# EAGLE design HallEffectModule (EAGLE 5.10)
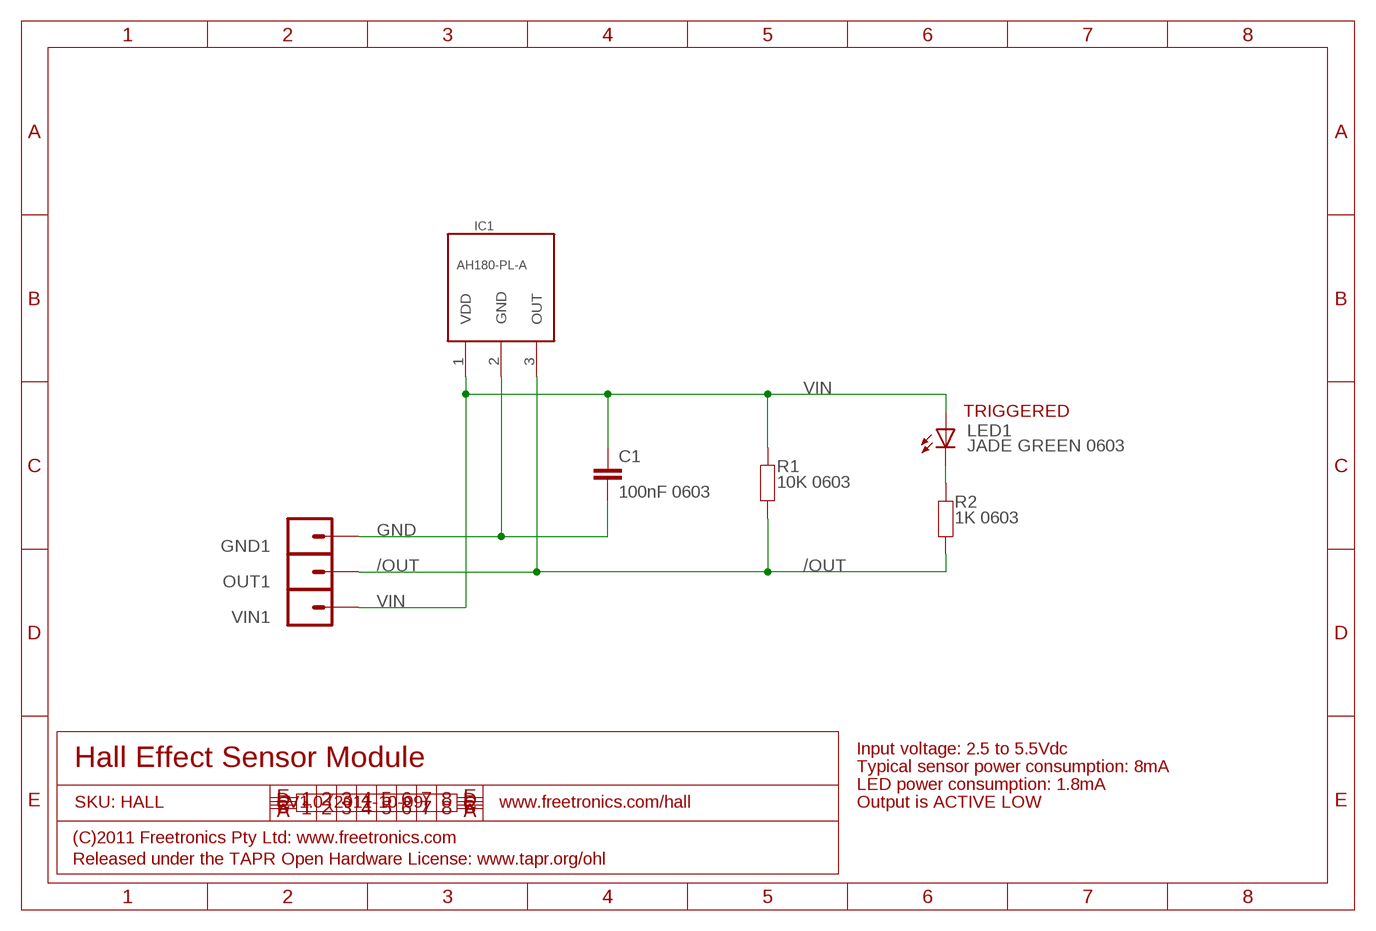
[diagram p0: schematic, sheet 1]

## Parts
C1  100nF 0603  CAP0603  [0603]
GND1  M01PTH  [1X01]
IC1  AH180-PL-A  US1881TO92  [TO92FLATUP]
LED1  JADE GREEN 0603  LED0603  [LED-0603]
OUT1  M01PTH  [1X01]
R1  10K 0603  RESISTOR0603  [0603]
R2  1K 0603  RESISTOR0603  [0603]
VIN1  M01PTH  [1X01]

## Nets
/OUT: IC1.3(OUT) OUT1.1 R1.1 R2.2
GND: C1.2 GND1.1 IC1.2(GND)
N$1: LED1.C R2.1
VIN: C1.1 IC1.1(VDD) LED1.A R1.2 VIN1.1

## Notes on the sheet
- TRIGGERED
- Input voltage: 2.5 to 5.5Vdc
- Hall Effect Sensor Module
- Typical sensor power consumption: 8mA
- LED power consumption: 1.8mA
- SKU: HALL | V1.0 (2011-10-09) | www.freetronics.com/hall | Output is ACTIVE LOW
- (C)2011 Freetronics Pty Ltd: www.freetronics.com
- Released under the TAPR Open Hardware License: www.tapr.org/ohl

## Library data of the parts
C1 = freetronics-master-v1.1:CAP: Capacitor Standard 0603 ceramic capacitor, and 0.1" leaded capacitor.
GND1 OUT1 VIN1 = freetronics-master-v1:M01: Header 1 Standard 1-pin 0.1" header. Use with straight break away headers (SKU : PRT-00116), right angle break away headers (PRT-00553), swiss pins (PRT-00743), machine pins (PRT-00117), and female headers (PRT-00115).
IC1 = freetronics-jon:US1881
LED1 = freetronics-marc:LED: LEDs Standard schematic elements and footprints for 5mm, 3mm, 1206, and 0603 sized LEDs. 5mm - Spark Fun Electronics SKU : COM-00529 (and others)
R1 R2 = freetronics-master-v1:RESISTOR: Resistor Basic schematic elements and footprints for 0603, 1206, and PTH 1/10th watt (small) resistors.

## Board
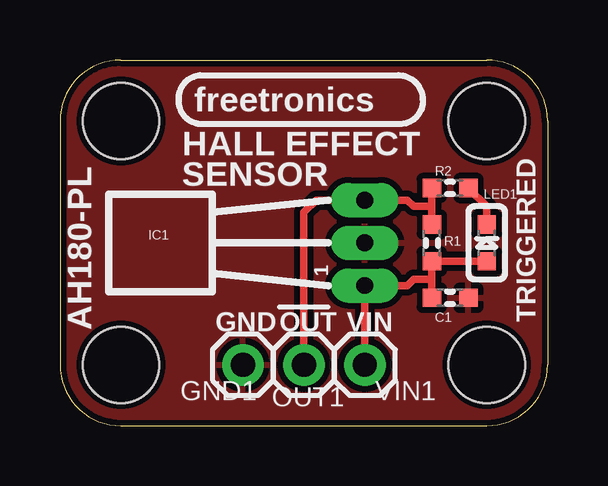
[diagram p1: board, top side]
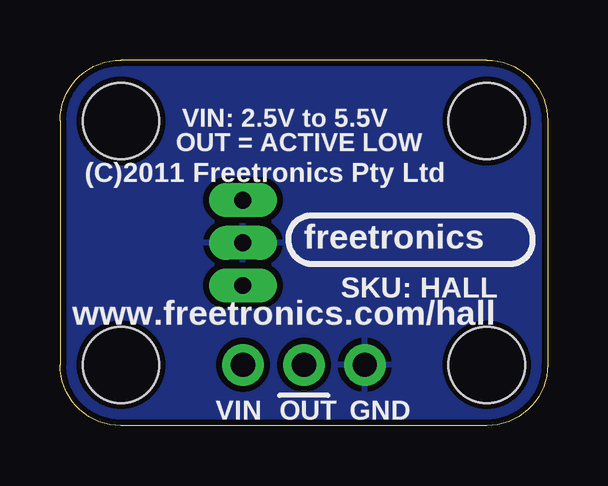
[diagram p2: board, bottom side, seen from below]

Size 20.32 x 15.24 mm. Coordinates in mm from the lower left corner, seen from the top.
Outline: 0,2.54 arc90 2.54,0 17.78,0 arc90 20.32,2.54 20.32,12.7 arc90 17.78,15.24 2.54,15.24 arc90 0,12.7 0,2.54
Copper layers (1*16): Top 0.035mm / dielectric 1.5mm / Bottom 0.035mm
Design rules "default *": minimum track width 8mil, minimum drill 15mil, track to track 10mil, track to pad 10mil, pad to pad 10mil, via to via 10mil, smd to smd 8mil, copper to edge 10mil, drill to drill 8mil, minimum pad ring 14mil, minimum via ring 8mil, stop-mask expansion 4mil, vias tented up to drill 25mil, thermal gap 10mil
Holes 3.17 mm at 2.54,2.54 17.78,2.54 2.54,12.7 17.78,12.7

### Footprints (pad centres in the part's own frame; a part is rotated, then mirrored left to right if it is on the bottom)
0603 = smd 0.762 x 0.762: 1 -0.762,0; 2 0.762,0
1X01 = drill 1.016 round: 1 0,0
TO92FLATUP = drill 0.7 long: 1 -1.778,0; 2 0,0; 3 1.778,0
LED-0603 = smd 0.762 x 0.762: A -0.762,0; C 0.762,0

### Placement (x,y rotation side)
C1  16.26,5.33 0 top
GND1  7.62,2.54 0 top
IC1  12.7,7.62 90 top
LED1  17.78,7.62 90 top
OUT1  10.16,2.54 0 top
R1  15.49,7.62 270 top
R2  16.26,9.91 180 top
VIN1  12.7,2.54 0 top

### Tracks (layer width: path | path; a pad name or v marks a point on that pad's centre or on a via)
/OUT
  Top 0.305: OUT1.1 10.16,8.89 10.67,9.4 IC1.3 14.48,9.4 14.73,9.14 15.49,9.14 | 15.49,9.14 R2.2 | 15.49,9.14 R1.1
GND
  pour Bottom: 2.54,15.24 arc90 0,12.7 0,2.54 arc90 2.54,0 17.78,0 arc90 20.32,2.54 20.32,12.7 arc90 17.78,15.24
  pour Top: 0,12.7 0,2.54 arc90 2.54,0 17.78,0 arc90 20.32,2.54 20.32,12.7 arc90 17.78,15.24 2.54,15.24 arc90
N$1
  Top 0.305: LED1.C 17.78,9.14 R2.1
VIN
  Top 0.305: VIN1.1 IC1.1 14.48,5.84 14.73,6.1 15.49,6.1 | 15.49,6.1 C1.1 | 15.49,6.1 R1.2 LED1.A

### Text on the board
tPlace: freetronics | HALL EFFECT | SENSOR | 1 | AH180-PL | GND | OUT | VIN | TRIGGERED
bPlace: VIN: 2.5V to 5.5V | OUT = ACTIVE LOW | (C)2011 Freetronics Pty Ltd | freetronics | SKU: HALL | www.freetronics.com/hall | GND | OUT | VIN